# Altium schematic sheet MCU.SchDoc
size B; SheetNumber: 5; SheetTotal: 6; SPICEModelCacheVOGBEKYM: <root> / <DocumentId>VOGBEKYM</DocumentId> / <CacheFrame Number="0"> / <Model Name="xtal" Kind="CKT"> / <Text>*Generic type:crystal pkg:HC33/51 / .SUBCKT XTAL 1 2 PARAMS: FREQ=1Meg RS=750 C=13pf Q=1000 / LX 1 3 {((Q*RS)/(6.2831852*FREQ))} IC=0.5M / CX 3 4 {(1/(Q*6.2831852*FREQ*RS))} / C0 1 2 {C} / RS 4 2 {RS} / .ENDS XTAL</Text> / </Model> / </CacheFrame> / </root>
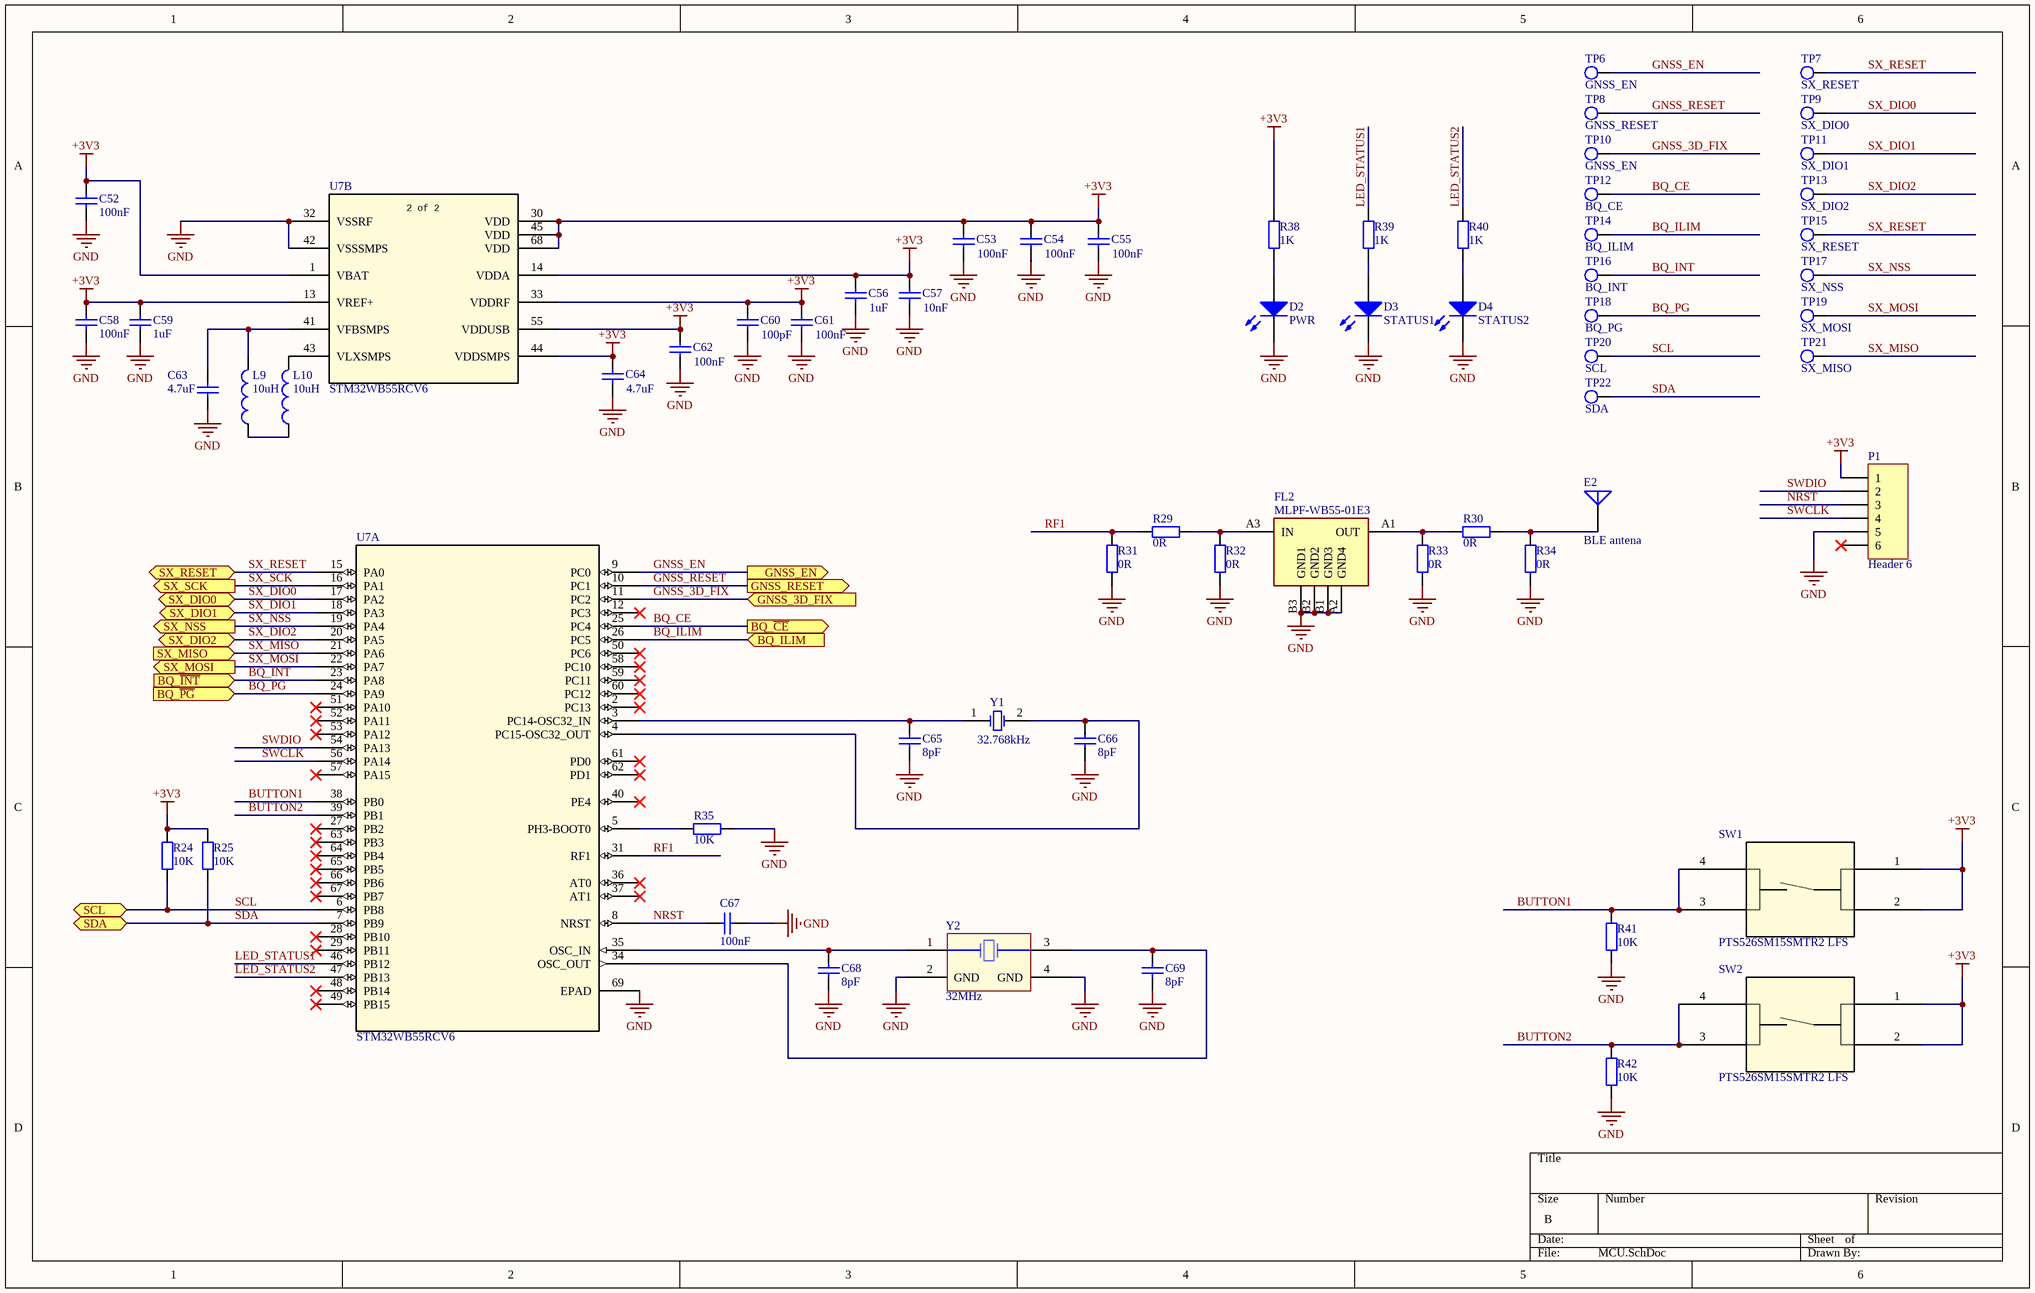
[diagram p0: MCU.SchDoc]

## Parts
C52  100nF  [0402]
C53  100nF  [0402]
C54  100nF  [0402]
C55  100nF  [0402]
C56  1uF  [0402]
C57  10nF  [0402]
C58  100nF  [0402]
C59  1uF  [0402]
C60  100pF  [0402]
C61  100nF  [0402]
C62  100nF  [0402]
C63  4.7uF  [0402]
C64  4.7uF  [0402]
C65  8pF  [0402]
C66  8pF  [0402]
C67  100nF  [0402]
C68  8pF  [0402]
C69  8pF  [0402]
D2  PWR
D3  STATUS1
D4  STATUS2
E2  BLE antena  [204286-0001_MOL]
FL2  MLPF-WB55-01E3  [MLPF-WB55-01E3]
L9  value 10uH  [0402-A]  (hidden comment: Inductor)
L10  value 10uH  [0402-A]  (hidden comment: Inductor)
P1  Header 6  [TAG_TC2030-IDC-NL]
R24  10K  [SMD-0402-RES]
R25  10K  [SMD-0402-RES]
R29  0R  [SMD-0402-RES]
R30  0R  [SMD-0402-RES]
R31  0R  [SMD-0402-RES]
R32  0R  [SMD-0402-RES]
R33  0R  [SMD-0402-RES]
R34  0R  [SMD-0402-RES]
R35  10K  [SMD-0402-RES]
R38  1K  [SMD-0402-RES]
R39  1K  [SMD-0402-RES]
R40  1K  [SMD-0402-RES]
R41  10K  [SMD-0402-RES]
R42  10K  [SMD-0402-RES]
SW1  PTS526SM15SMTR2 LFS  [PTS526SM15SMTR2 LFS]
SW2  PTS526SM15SMTR2 LFS  [PTS526SM15SMTR2 LFS]
TP6  GNSS_EN  [testpoint 1 mm]  (no BOM)
TP7  SX_RESET  [testpoint 1 mm]  (no BOM)
TP8  GNSS_RESET  [testpoint 1 mm]  (no BOM)
TP9  SX_DIO0  [testpoint 1 mm]  (no BOM)
TP10  GNSS_EN  [testpoint 1 mm]  (no BOM)
TP11  SX_DIO1  [testpoint 1 mm]  (no BOM)
TP12  BQ_CE  [testpoint 1 mm]  (no BOM)
TP13  SX_DIO2  [testpoint 1 mm]  (no BOM)
TP14  BQ_ILIM  [testpoint 1 mm]  (no BOM)
TP15  SX_RESET  [testpoint 1 mm]  (no BOM)
TP16  BQ_INT  [testpoint 1 mm]  (no BOM)
TP17  SX_NSS  [testpoint 1 mm]  (no BOM)
TP18  BQ_PG  [testpoint 1 mm]  (no BOM)
TP19  SX_MOSI  [testpoint 1 mm]  (no BOM)
TP20  SCL  [testpoint 1 mm]  (no BOM)
TP21  SX_MISO  [testpoint 1 mm]  (no BOM)
TP22  SDA  [testpoint 1 mm]  (no BOM)
U7  STM32WB55RCV6  [STM32WB55RCV6]  (parts A,B of 2)
Y1  32.768kHz  [CM8V-T1A-32.768kHz-7pF-20PPM-TA-QC]
Y2  32MHz  [ECS-TXO-20CSMV-320-EY-TR]

## Ports
BQ_ILIM (in, see Battery charger[4A]), BQ_~{CE} (out, see Battery charger[1C]), BQ_~{INT} (in, see Battery charger[1B]), BQ_~{PG} (in, see Battery charger[1C]), GNSS_3D_FIX (in, see GNSS modulis[3C]), GNSS_EN (out, see GNSS modulis[2B]), GNSS_RESET (out, see GNSS modulis[3C]), SCL (bidir, see Battery charger[1B], GNSS modulis[3B]), SDA (bidir, see Battery charger[1B], GNSS modulis[3B]), SX_DIO0 (bidir, see RF Front End[3B]), SX_DIO1 (bidir, see RF Front End[3B]), SX_DIO2 (bidir, see RF Front End[3B]), SX_MISO (in, see RF Front End[2B]), SX_MOSI (out, see RF Front End[2B]), SX_NSS (out, see RF Front End[2B]), SX_RESET (bidir, see RF Front End[1B]), SX_SCK (out, see RF Front End[2B])

## Nets
+3V3: C52.2 C53.2 C54.2 C55.2 C56.2 C57.2 C58.2 C59.2 C60.2 C61.2 C62.2 C64.2 P1.1 R24.2 R25.2 R38.1 SW1.1 SW1.2 SW2.1 SW2.2 U7.1(VBAT) U7.13(VREF+) U7.14(VDDA) U7.30(VDD) U7.33(VDDRF) U7.44(VDDSMPS) U7.45(VDD) U7.55(VDDUSB) U7.68(VDD)
GND: C52.1 C53.1 C54.1 C55.1 C56.1 C57.1 C58.1 C59.1 C60.1 C61.1 C62.1 C63.1 C64.1 C65.2 C66.2 C67.1 C68.2 C69.2 D2.2(K) D3.2(K) D4.2(K) FL2.A2(GND4) FL2.B1(GND3) FL2.B2(GND2) FL2.B3(GND1) P1.5 R31.1 R32.1 R33.1 R34.1 R35.2 R41.2 R42.2 U7.32(VSSRF) U7.42(VSSSMPS) U7.69(EPAD) Y2.2(GND) Y2.4(GND)
BQ_CE: TP12.1 U7.25(PC4) ; port BQ_~{CE}
BQ_ILIM: TP14.1 U7.26(PC5) ; port BQ_ILIM
BQ_INT: TP16.1 U7.23(PA8) ; port BQ_~{INT}
BQ_PG: TP18.1 U7.24(PA9) ; port BQ_~{PG}
BUTTON1: R41.1 SW1.3 SW1.4 U7.38(PB0)
BUTTON2: R42.1 SW2.3 SW2.4 U7.39(PB1)
GNSS_3D_FIX: TP10.1 U7.11(PC2) ; port GNSS_3D_FIX
GNSS_EN: TP6.1 U7.9(PC0) ; port GNSS_EN
GNSS_RESET: TP8.1 U7.10(PC1) ; port GNSS_RESET
LED_STATUS1: R39.1 U7.46(PB12)
LED_STATUS2: R40.1 U7.47(PB13)
NRST: C67.2 P1.3 U7.8(NRST)
RF1: R29.2 R31.2 U7.31(RF1)
SCL: R24.1 TP20.1 U7.6(PB8) ; port SCL
SDA: R25.1 TP22.1 U7.7(PB9) ; port SDA
SWCLK: P1.4 U7.56(PA14)
SWDIO: P1.2 U7.54(PA13)
SX_DIO0: TP9.1 U7.17(PA2) ; port SX_DIO0
SX_DIO1: TP11.1 U7.18(PA3) ; port SX_DIO1
SX_DIO2: TP13.1 U7.20(PA5) ; port SX_DIO2
SX_MISO: TP21.1 U7.21(PA6) ; port SX_MISO
SX_MOSI: TP19.1 U7.22(PA7) ; port SX_MOSI
SX_NSS: TP17.1 U7.19(PA4) ; port SX_NSS
SX_RESET: TP7.1 TP15.1 U7.15(PA0) ; port SX_RESET
SX_SCK: U7.16(PA1) ; port SX_SCK
NetC63_2: C63.2 L9.2 U7.41(VFBSMPS)
NetC65_1: C65.1 U7.3(PC14-OSC32_IN) Y1.1(OSC1)
NetC66_1: C66.1 U7.4(PC15-OSC32_OUT) Y1.2(OSC2)
NetC68_1: C68.1 U7.35(OSC_IN) Y2.1
NetC69_1: C69.1 U7.34(OSC_OUT) Y2.3
NetD2_1: D2.1(A) R38.2
NetD3_1: D3.1(A) R39.2
NetD4_1: D4.1(A) R40.2
NetE2_1: E2.1(A) R30.1 R34.2
NetFL2_A1: FL2.A1(OUT) R30.2 R33.2
NetFL2_A3: FL2.A3(IN) R29.1 R32.2
NetL9_1: L9.1 L10.1
NetL10_2: L10.2 U7.43(VLXSMPS)
NetR35_1: R35.1 U7.5(PH3-BOOT0)

Not connected (* = marked no-connect by the designer): P1 6*; U7 2(PC13)* 12(PC3)* 27(PB2)* 28(PB10)* 29(PB11)* 36(AT0)* 37(AT1)* 40(PE4)* 48(PB14)* 49(PB15)* 50(PC6)* 51(PA10)* 52(PA11)* 53(PA12)* 57(PA15)* 58(PC10)* 59(PC11)* 60(PC12)* 61(PD0)* 62(PD1)* 63(PB3)* 64(PB4)* 65(PB5)* 66(PB6)* 67(PB7)*

## Notes on the sheet
- (in symbol STM32WB55RCV6, part B) 2 of 2

## Library data of the parts
C52-C69 = Cap: Capacitor; Published: 8-Jun-2000; LatestRevisionDate: 17-Jul-2002; LatestRevisionNote: Re-released for DXP Platform.; PackageReference: RAD-0.3; Publisher: Altium Limited; PackageDescription: Radial Cap, Thru-Hole; 2 Leads; 0.3 in Pin Spacing
D2-D4 = LED: SML-D12P8WT86; AF: 1; BV: 0; BV_MAX: 1e99; EG: 1.11; FC: 0.5; IBV: 0.001; IS: 1e-14; MJSW: 0.33; NTUN: 30; TNOM: 27; XTI: 3; SimulationGenericComponent: True; CJO: 0; CJP: 0; CTA: 0; CTP: 0; FCS: 0.5; FV_MAX: 1e99; IKF: 0; IKR: 0; ISR: 1e-14; JSW: 0; JTUN: 0; JTUNSW: 0; KEG: 1; KF: 0; LEVEL: 1; N: 1; NBV: 1; NR: 1; NS: 1; PHP: 1; RS: 0; TCV: 0; TLEV: 0; TLEVC: 0; TM1: 0; TM2: 0; TPB: 0; TPHP: 0; TRS: 0; TRS2: 0; TT: 0; TTT1: 0; TTT2: 0; VJ: 1; XTITUN: 3
E2 = Antenna: Generic Antenna; Published: 24-Mar-1999; LatestRevisionDate: 17-Jul-2002; LatestRevisionNote: Re-released for DXP Platform.; PackageReference: PIN1; Publisher: Altium Limited
FL2 = MLPF-WB55-01E3: Manufacturer_Name: STMicroelectronics; Datasheet Link: https://www.st.com/resource/en/datasheet/mlpf-wb55-01e3.pdf; Manufacturer_Part_Number: MLPF-WB55-01E3; Mouser Part Number: 511-MLPF-WB55-01E3; Mouser Price/Stock: https://www.mouser.co.uk/ProductDetail/STMicroelectronics/MLPF-WB55-01E3?qs=vLWxofP3U2xV%2FkxL9PmCDA%3D%3D; Arrow Part Number: MLPF-WB55-01E3; Arrow Price/Stock: https://www.arrow.com/en/products/mlpf-wb55-01e3/stmicroelectronics?utm_currency=USD&region=nac
L9 L10 = Inductor: Code_IEC: 1005; Published: 8-Jun-2000; LatestRevisionDate: 29-May-2009; LatestRevisionNote: IPC-7351 Footprint Added.; PackageReference: 0402-A; Publisher: Altium Limited; PackageDescription: Chip Inductor; Code_JEITA: 0402
P1 = Header 6: Header, 6-Pin; LatestRevisionDate: 17-Jul-2002; LatestRevisionNote: Re-released for DXP Platform.; Publisher: Altium Limited
R24 R25 R29-R35 R38-R42 = Res2: Resistor; Published: 8-Jun-2000; LatestRevisionDate: 17-Jul-2002; LatestRevisionNote: Re-released for DXP Platform.; PackageReference: AXIAL-0.4; Publisher: Altium Limited; PackageDescription: Axial Device, Thru-Hole; 2 Leads; 0.4 in Pin Spacing
  R24 R25 R35 R41 R42: Value: 10K
  R29-R34: Value: 0R
  R38-R40: Value: 1K
SW1 SW2 = PTS526SM15SMTR2 LFS: Manufacturer_Name: C&K Components; Copyright: Copyright (C) 2026 Ultra Librarian. All rights reserved.; Manufacturer_Part_Number: PTS526 SM15 SMTR2 LFS; RefDes: RefDes; Type: Type
TP6-TP22 = testpoint
U7 = STM32WB55RCV6: Ultra-low-power dual core Arm Cortex-M4 MCU 64 MHz, Cortex-M0+ 32 MHz with 256 Kbytes of Flash memory, Bluetooth LE 5.4, 802.15.4, Zigbee, Thread, Matter, USB, LCD, AES-256; Manufacturer_Name: STMicroelectronics; Copyright: Copyright (C) 2025 Ultra Librarian. All rights reserved.; Manufacturer_Part_Number: STM32WB55RCV6; RefDes: RefDes; Type: Type
Y1 = XTAL: Crystal Oscillator / CM8V-T1A-32.768kHz-7pF-20PPM-TA-QC; Published: 8-Jun-2000; LatestRevisionDate: 17-Jul-2002; LatestRevisionNote: Re-released for DXP Platform.; PackageReference: R38; Publisher: Altium Limited; PackageDescription: Crystal, Thru-Hole; 2 Leads; Body 3.1 x 8.2 mm (Dia.xH)
Y2 = Xtal 4 pin: ECS-320-8-37B2-CGP-TR / Crystals 32.000 MHz 8 pF ECX-1637B2 +/-10/30ppm -40 - +105C +/-2 ppm Aging 2016 4-SMD RoHS